# Altium schematic sheet MCU.SchDoc: MCU Circuit
size A4; Engineer: M.GUENI; Organization: Altium Limited; Address1: L3, 12a Rodborough Rd; Address2: Frenchs Forest; Address3: NSW; Address4: Australia 2086; Revision: R0; SheetNumber: 8; SheetTotal: 8
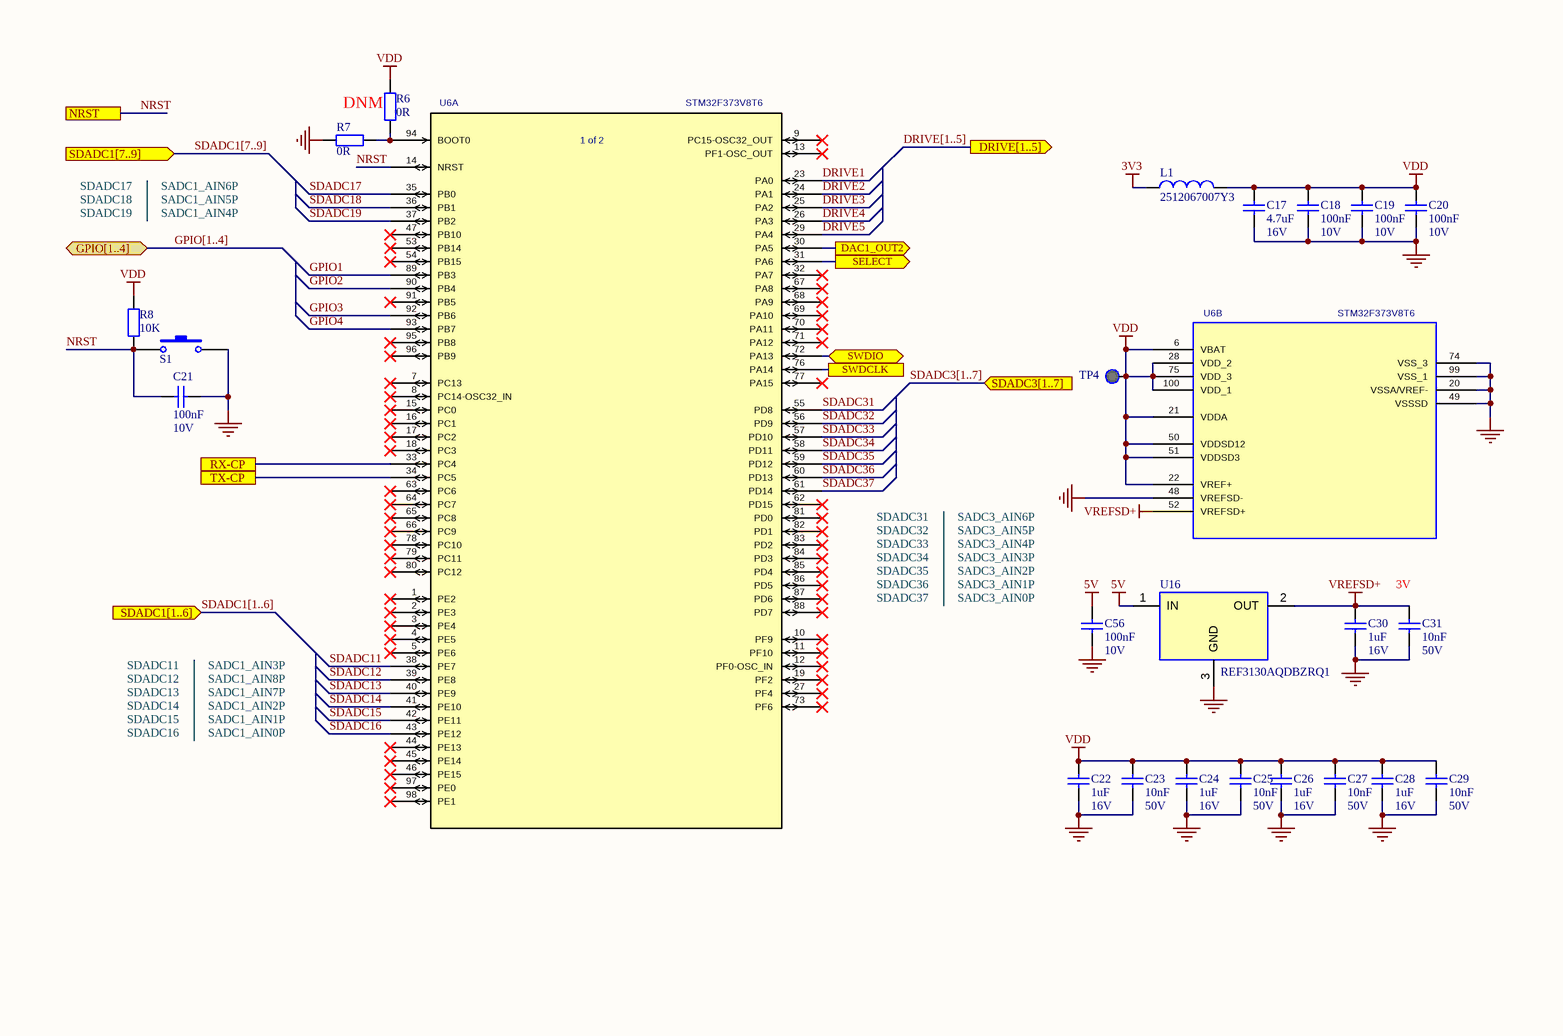
[diagram p0: MCU.SchDoc]

## Parts
C17  Value 1: 4.7uF  Value 2: 16V  [CAPC1608N]  (hidden comment: Capacitor)
C18  Value 1: 100nF  Value 2: 10V  [CAPC1608N]  (hidden comment: Capacitor)
C19  Value 1: 100nF  Value 2: 10V  [CAPC1608N]  (hidden comment: Capacitor)
C20  Value 1: 100nF  Value 2: 10V  [CAPC1608N]  (hidden comment: Capacitor)
C21  Value 1: 100nF  Value 2: 10V  [CAPC1608N]  (hidden comment: Capacitor)
C22  Value 1: 1uF  Value 2: 16V  [CAPC1608N]  (hidden comment: Capacitor)
C23  Value 1: 10nF  Value 2: 50V  [CAPC1608N]  (hidden comment: Capacitor)
C24  Value 1: 1uF  Value 2: 16V  [CAPC1608N]  (hidden comment: Capacitor)
C25  Value 1: 10nF  Value 2: 50V  [CAPC1608N]  (hidden comment: Capacitor)
C26  Value 1: 1uF  Value 2: 16V  [CAPC1608N]  (hidden comment: Capacitor)
C27  Value 1: 10nF  Value 2: 50V  [CAPC1608N]  (hidden comment: Capacitor)
C28  Value 1: 1uF  Value 2: 16V  [CAPC1608N]  (hidden comment: Capacitor)
C29  Value 1: 10nF  Value 2: 50V  [CAPC1608N]  (hidden comment: Capacitor)
C30  Value 1: 1uF  Value 2: 16V  [CAPC1608N]  (hidden comment: Capacitor)
C31  Value 1: 10nF  Value 2: 50V  [CAPC1608N]  (hidden comment: Capacitor)
C56  Value 1: 100nF  Value 2: 10V  [CAPC1608N]  (hidden comment: Capacitor)
L1  2512067007Y3  [INDC3216N]
R6  Value 1: 0R  [RESC1608N]  (hidden comment: Resistor)
R7  Value 1: 0R  [RESC1608N]  (hidden comment: Resistor)
R8  Value 1: 10K  [RESC1608N]  (hidden comment: Resistor)
S1  FSM4JSMA  [FSM4]  (value not drawn)
TP4  Test Point  [TP]  (value not drawn)  (no BOM)
U6  STM32F373V8T6  [LQFP100]  (parts A,B of 2)
U16  REF3130AQDBZRQ1  [SOT23-3N]

## Ports
DAC1_OUT2 (out), DRIVE[1..5] (out), GPIO[1..4] (bidir), NRST, RX-CP, SDADC1[1..6] (in), SDADC1[7..9] (in), SDADC3[1..7] (in), SELECT (out), SWDCLK, SWDIO (bidir), TX-CP

## Nets
3V3: L1.1
5V: C56.2 U16.1(IN)
GND: C17.2 C18.1 C19.1 C20.1 C21.1 C22.1 C23.1 C24.1 C25.1 C26.1 C27.1 C28.1 C29.1 C30.1 C31.1 C56.1 R7.1 S1.2 U6.20(VSSA/VREF-) U6.48(VREFSD-) U6.49(VSSSD) U6.74(VSS_3) U6.99(VSS_1) U16.3(GND)
VDD: C17.1 C18.2 C19.2 C20.2 C22.2 C23.2 C24.2 C25.2 C26.2 C27.2 C28.2 C29.2 L1.2 R6.2 R8.1 TP4.1 U6.6(VBAT) U6.21(VDDA) U6.22(VREF+) U6.28(VDD_2) U6.50(VDDSD12) U6.51(VDDSD3) U6.75(VDD_3) U6.100(VDD_1)
VREFSD+: C30.2 C31.2 U6.52(VREFSD+) U16.2(OUT)
DAC1_OUT2: U6.30(PA5) ; port DAC1_OUT2
DRIVE1: U6.23(PA0)
DRIVE2: U6.24(PA1)
DRIVE3: U6.25(PA2)
DRIVE4: U6.26(PA3)
DRIVE5: U6.29(PA4)
GPIO1: U6.89(PB3)
GPIO2: U6.90(PB4)
GPIO3: U6.92(PB6)
GPIO4: U6.93(PB7)
NRST: C21.2 R8.2 S1.1 U6.14(NRST) ; port NRST
RX-CP: U6.33(PC4) ; port RX-CP
SDADC11: U6.38(PE7)
SDADC12: U6.39(PE8)
SDADC13: U6.40(PE9)
SDADC14: U6.41(PE10)
SDADC15: U6.42(PE11)
SDADC16: U6.43(PE12)
SDADC17: U6.35(PB0)
SDADC18: U6.36(PB1)
SDADC19: U6.37(PB2)
SDADC31: U6.55(PD8)
SDADC32: U6.56(PD9)
SDADC33: U6.57(PD10)
SDADC34: U6.58(PD11)
SDADC35: U6.59(PD12)
SDADC36: U6.60(PD13)
SDADC37: U6.61(PD14)
SELECT: U6.31(PA6) ; port SELECT
SWDCLK: U6.76(PA14) ; port SWDCLK
SWDIO: U6.72(PA13) ; port SWDIO
TX-CP: U6.34(PC5) ; port TX-CP
NetR6_1: R6.1 R7.2 U6.94(BOOT0)

Not connected (* = marked no-connect by the designer): U6 1(PE2)* 2(PE3)* 3(PE4)* 4(PE5)* 5(PE6)* 7(PC13)* 8(PC14-OSC32_IN)* 9(PC15-OSC32_OUT)* 10(PF9)* 11(PF10)* 12(PF0-OSC_IN)* 13(PF1-OSC_OUT)* 15(PC0)* 16(PC1)* 17(PC2)* 18(PC3)* 19(PF2)* 27(PF4)* 32(PA7)* 44(PE13)* 45(PE14)* 46(PE15)* 47(PB10)* 53(PB14)* 54(PB15)* 62(PD15)* 63(PC6)* 64(PC7)* 65(PC8)* 66(PC9)* 67(PA8)* 68(PA9)* 69(PA10)* 70(PA11)* 71(PA12)* 73(PF6)* 77(PA15)* 78(PC10)* 79(PC11)* 80(PC12)* 81(PD0)* 82(PD1)* 83(PD2)* 84(PD3)* 85(PD4)* 86(PD5)* 87(PD6)* 88(PD7)* 91(PB5)* 95(PB8)* 96(PB9)* 97(PE0)* 98(PE1)*

## Buses and harness runs
bus DRIVE[1..5] = port DRIVE[1..5]
bus GPIO[1..4] = port GPIO[1..4]
bus SDADC1[1..6] = port SDADC1[1..6]
bus SDADC1[7..9] = port SDADC1[7..9]
bus SDADC3[1..7] = port SDADC3[1..7]

## Notes on the sheet
- DNM
- SDADC18
- SDADC17
- SDADC19
- SADC1_AIN6P
- SADC1_AIN5P
- SADC1_AIN4P
- SDADC31
- SADC3_AIN6P
- SDADC32
- SDADC33
- SDADC34
- SDADC35
- SADC3_AIN5P
- SADC3_AIN4P
- SADC3_AIN3P
- SADC3_AIN2P
- SDADC36
- SDADC37
- SADC3_AIN1P
- SADC3_AIN0P
- (near C31) 3V
- SDADC11
- SDADC12
- SDADC13
- SDADC14
- SADC1_AIN3P
- SADC1_AIN8P
- SADC1_AIN7P
- SADC1_AIN2P
- SDADC15
- SDADC16
- SADC1_AIN1P
- SADC1_AIN0P
- THIS DOCUMENT AND THE DATA DISCLOSED HEREIN OR
- HEREWITH IS THE PROPERTY OF ALTIUM LIMITED AND MAY
- DWG NO:
- REVISION
- REV:
- DESCRIPTION
- DATE
- APPROVED
- BE FREELY DISTRIBUTED IN WHOLE. NO RIGHTS ARE
- RESERVED OR EXPRESS OR IMPLIED WARANTEE GIVEN.
- ENG:
- APPROVALS
- PROJECT
- DSN:
- CHK:
- REFERENCE DOCUMENTS
- PROJECT REVISION:
- TITLE
- DOCUMENT REVISION:
- DESIGN ITEM:
- BOM:
- FAB DWG:
- PCB DWG:
- ASSY DWG:
- SCALE:
- A3
- SIZE
- CAGE CODE
- FILE NAME
- DWG NO.
- SHEET
- OF
- REV
- (in symbol MCU-000000001, part A) 1 of 2
- (in symbol MCU-000000001, part B) 2 of 2

## Library data of the parts
C17 = CAP-000000047: MAN: Murata Electronics; MANREF: GRM188C71C475KE21D; DES: Multilayer Ceramic Capacitors MLCC - SMD/SMT 4.7UF 16V 10% 0603; TOL: 10%; FTP: 0603; SUP: Mouser; SUPREF: 81-GRM188C71C475KE1D; NOTE: _; Part Number: CAP-000000047
C18-C21 C56 = CAP-000000005: MAN: KEMET; MANREF: C0603X104K8RACTU; DES: C0603X104K8RACTU -  Condensateur céramique multicouche CMS, 0.1 µF, 10 V, 0603 [1608 Metric], ± 10%, X7R; TOL: 10%; FTP: 0603; SUP: Farnell; SUPREF: 2904937; NOTE: _; Part Number: CAP-000000005
C22 C24 C26 C28 C30 = CAP-000000011: MAN: MULTICOMP; MANREF: MC0603F105Z160CT; DES: MULTICOMP 	MC0603F105Z160CT  Condensateur céramique multicouche CMS, Série MC, 1 µF, +80%, -20%, Y5V, 16 V, 0603 [1608 Metric]; TOL: +80% -20%; FTP: 0603; SUP: Farnell; SUPREF: 1759408; NOTE: _; Part Number: CAP-000000011
C23 C25 C27 C29 C31 = CAP-000000003: MAN: MULTICOMP; MANREF: 06035C103JAT2A; DES: 06035C103JAT2A -  Condensateur céramique multicouche CMS, 10000 pF, 50 V, 0603 [1608 Metric], ± 5%, X7R; TOL: 5%; FTP: 0603; SUP: Farnell; SUPREF: 1833871; NOTE: _; Part Number: CAP-000000003
L1 = FER-000000001: MAN: FAIR-RITE; DES: 2512067007Y3 -  Perle de ferrite, 1206 [3216 Metric], 70 ohm, 3 A, 0.04 ohm, ± 25%; Value 1: 70Ohm; Value 2: 0R04; TOL: 25%; FTP: 1206; SUP: Farnell; SUPREF: 1653393; NOTE: _; Part Number: FER-000000001; MANREF: 2512067007Y3
R6 R7 = RES-000000103: MAN: Vishay / Beyschlag; MANREF: MCT06030Z0000ZP500; DES: Thin Film Resistors - SMD Zero ohm Jumper; Value 2: 0.125W; TOL: _; FTP: 0603; SUP: Mouser; SUPREF: 594-MCT06030Z0000ZP5; Part Number: RES-000000103; NOTE: _
R8 = RES-000000001: MAN: YAGEO; MANREF: RC0603FR-0710KL; DES: YAGEO (PHYCOMP)  RC0603FR-0710KL  RESISTANCE COUCHE EPAISSE 10K 0.1W 1%; Value 2: 0.1W; TOL: 1%; FTP: 0603; SUP: Farnell; SUPREF: 9238603; NOTE: _; Part Number: RES-000000001
S1 = SWC-000000004: MAN: ALCOSWITCH - TE CONNECTIVITY; DES: Commutateur tactile, Série FSMJSMA, A déclencheur supérieur, Montage en surface, Bouton rond; Value 1: _; SUP: Farnell; SUPREF: 3801305; Part Number: SWC-000000004; MANREF: FSM4JSMA; Value 2: _; TOL: _; FTP: _; NOTE: _
TP4 = MIS-000000003: MAN: _; Part Number: MIS-000000003; MANREF: _; DES: _; Value 1: _; Value 2: _; TOL: _; FTP: _; SUP: _; SUPREF: _; NOTE: _
U6 = MCU-000000001: MAN: STMicroelectronics; DES: ARM Microcontrollers - MCU 32-Bit ARM Cortex M4 72MHz 64kB MCU FPU; Value 1: _; FTP: LQFP-100; SUP: Mouser; SUPREF: 511-STM32F373V8T6; Part Number: MCU-000000001; MANREF: STM32F373V8T6; Value 2: _; TOL: _; NOTE: _
U16 = VRF-000000001: MAN: Texas Instruments; DES: Voltage References Automotive 20-ppm/-C (max), 100--A, 3-pin SOT-23 series voltage reference 3-SOT-23 -40 to 125; Value 1: 3V; Value 2: _; TOL: 0.2 %; FTP: SOT-23-3; SUP: Mouser; SUPREF: 595-REF3130AQDBZRQ1; Part Number: VRF-000000001; MANREF: REF3130AQDBZRQ1; NOTE: _